# Altium schematic sheet FRU_Programmer_LPC.SchDoc: FMC Low-pin-count (LPC) carrier-card connector
size A4; Date: 02.03.2021; DrawnBy: BER; Engineer: PFH; Revision: B; SheetNumber: 2; SheetTotal: 2; Projekt: FRU Programmer for FPGA mezzanine cards (FMC); Website: www.fmchub.com
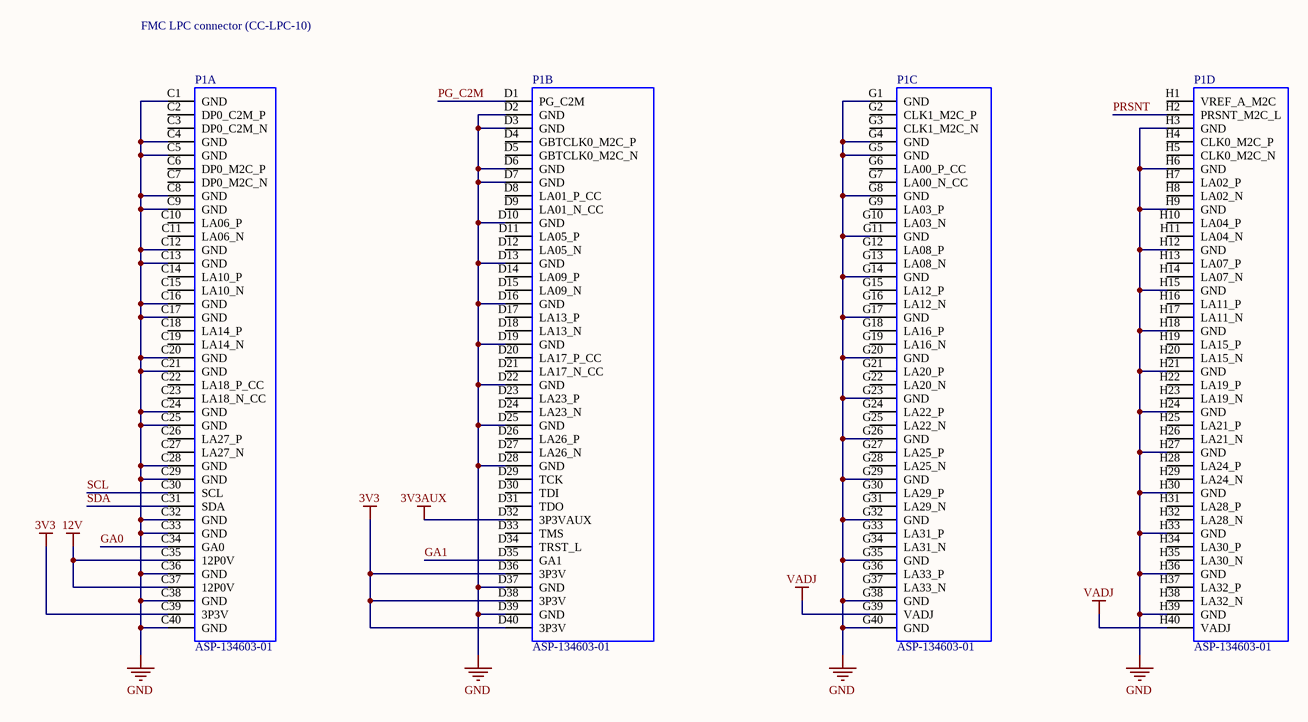
[diagram p0: FRU_Programmer_LPC.SchDoc]

## Parts
P1  ASP-134603-01  [ASP-134603-01]  (parts A,B,C,D of 4)

## Nets
3V3: P1.C39(3P3V) P1.D36(3P3V) P1.D38(3P3V) P1.D40(3P3V)
3V3AUX: P1.D32(3P3VAUX)
12V: P1.C35(12P0V) P1.C37(12P0V)
GND: P1.C1(GND) P1.C4(GND) P1.C5(GND) P1.C8(GND) P1.C9(GND) P1.C12(GND) P1.C13(GND) P1.C16(GND) P1.C17(GND) P1.C20(GND) P1.C21(GND) P1.C24(GND) P1.C25(GND) P1.C28(GND) P1.C29(GND) P1.C32(GND) P1.C33(GND) P1.C36(GND) P1.C38(GND) P1.C40(GND) P1.D2(GND) P1.D3(GND) P1.D6(GND) P1.D7(GND) P1.D10(GND) P1.D13(GND) P1.D16(GND) P1.D19(GND) P1.D22(GND) P1.D25(GND) P1.D28(GND) P1.D37(GND) P1.D39(GND) P1.G1(GND) P1.G4(GND) P1.G5(GND) P1.G8(GND) P1.G11(GND) P1.G14(GND) P1.G17(GND) P1.G20(GND) P1.G23(GND) P1.G26(GND) P1.G29(GND) P1.G32(GND) P1.G35(GND) P1.G38(GND) P1.G40(GND) P1.H3(GND) P1.H6(GND) P1.H9(GND) P1.H12(GND) P1.H15(GND) P1.H18(GND) P1.H21(GND) P1.H24(GND) P1.H27(GND) P1.H30(GND) P1.H33(GND) P1.H36(GND) P1.H39(GND)
VADJ: P1.G39(VADJ) P1.H40(VADJ)
GA0: P1.C34(GA0)
GA1: P1.D35(GA1)
PG_C2M: P1.D1(PG_C2M)
PRSNT: P1.H2(PRSNT_M2C_L)
SCL: P1.C30(SCL)
SDA: P1.C31(SDA)

Not connected (* = marked no-connect by the designer): P1 C2(DP0_C2M_P) C3(DP0_C2M_N) C6(DP0_M2C_P) C7(DP0_M2C_N) C10(LA06_P) C11(LA06_N) C14(LA10_P) C15(LA10_N) C18(LA14_P) C19(LA14_N) C22(LA18_P_CC) C23(LA18_N_CC) C26(LA27_P) C27(LA27_N) D4(GBTCLK0_M2C_P) D5(GBTCLK0_M2C_N) D8(LA01_P_CC) D9(LA01_N_CC) D11(LA05_P) D12(LA05_N) D14(LA09_P) D15(LA09_N) D17(LA13_P) D18(LA13_N) D20(LA17_P_CC) D21(LA17_N_CC) D23(LA23_P) D24(LA23_N) D26(LA26_P) D27(LA26_N) D29(TCK) D30(TDI) D31(TDO) D33(TMS) D34(TRST_L) G2(CLK1_M2C_P) G3(CLK1_M2C_N) G6(LA00_P_CC) G7(LA00_N_CC) G9(LA03_P) G10(LA03_N) G12(LA08_P) G13(LA08_N) G15(LA12_P) G16(LA12_N) G18(LA16_P) G19(LA16_N) G21(LA20_P) G22(LA20_N) G24(LA22_P) G25(LA22_N) G27(LA25_P) G28(LA25_N) G30(LA29_P) G31(LA29_N) G33(LA31_P) G34(LA31_N) G36(LA33_P) G37(LA33_N) H1(VREF_A_M2C) H4(CLK0_M2C_P) H5(CLK0_M2C_N) H7(LA02_P) H8(LA02_N) H10(LA04_P) H11(LA04_N) H13(LA07_P) H14(LA07_N) H16(LA11_P) H17(LA11_N) H19(LA15_P) H20(LA15_N) H22(LA19_P) H23(LA19_N) H25(LA21_P) H26(LA21_N) H28(LA24_P) H29(LA24_N) H31(LA28_P) H32(LA28_N) H34(LA30_P) H35(LA30_N) H37(LA32_P) H38(LA32_N)

## Notes on the sheet
- FMC LPC connector (CC-LPC-10)
- Title:
- Project:
- Date:
- Website:
- Rev:
- Engineer:
- Sheet:
- /

## Library data of the parts
P1 = CC-LPC-10: CC-LPC-10, FMC Low-pin count connector, lead free, 160 I/Os, female, 10 mm mated stack height; Manufacturer: Samtec; Manufacturer Ref: SEAF-40-06.5-10-A; Pitch: 1.27 mm; Mated Stack Height: 10 mm; Solder Type: Lead-Free; Number I/O: 160; PartName: ASP-134603-01; Part: ASP-134603-01; Vita PartNumber: CC-LPC-10; Pin Count: Low; Gender: female; Supplier 1: Digi-Key; Supplier Part Number 1: SAM8729-ND